# EAGLE design EMGPreamp_extRefv4 (EAGLE 6.6.0)
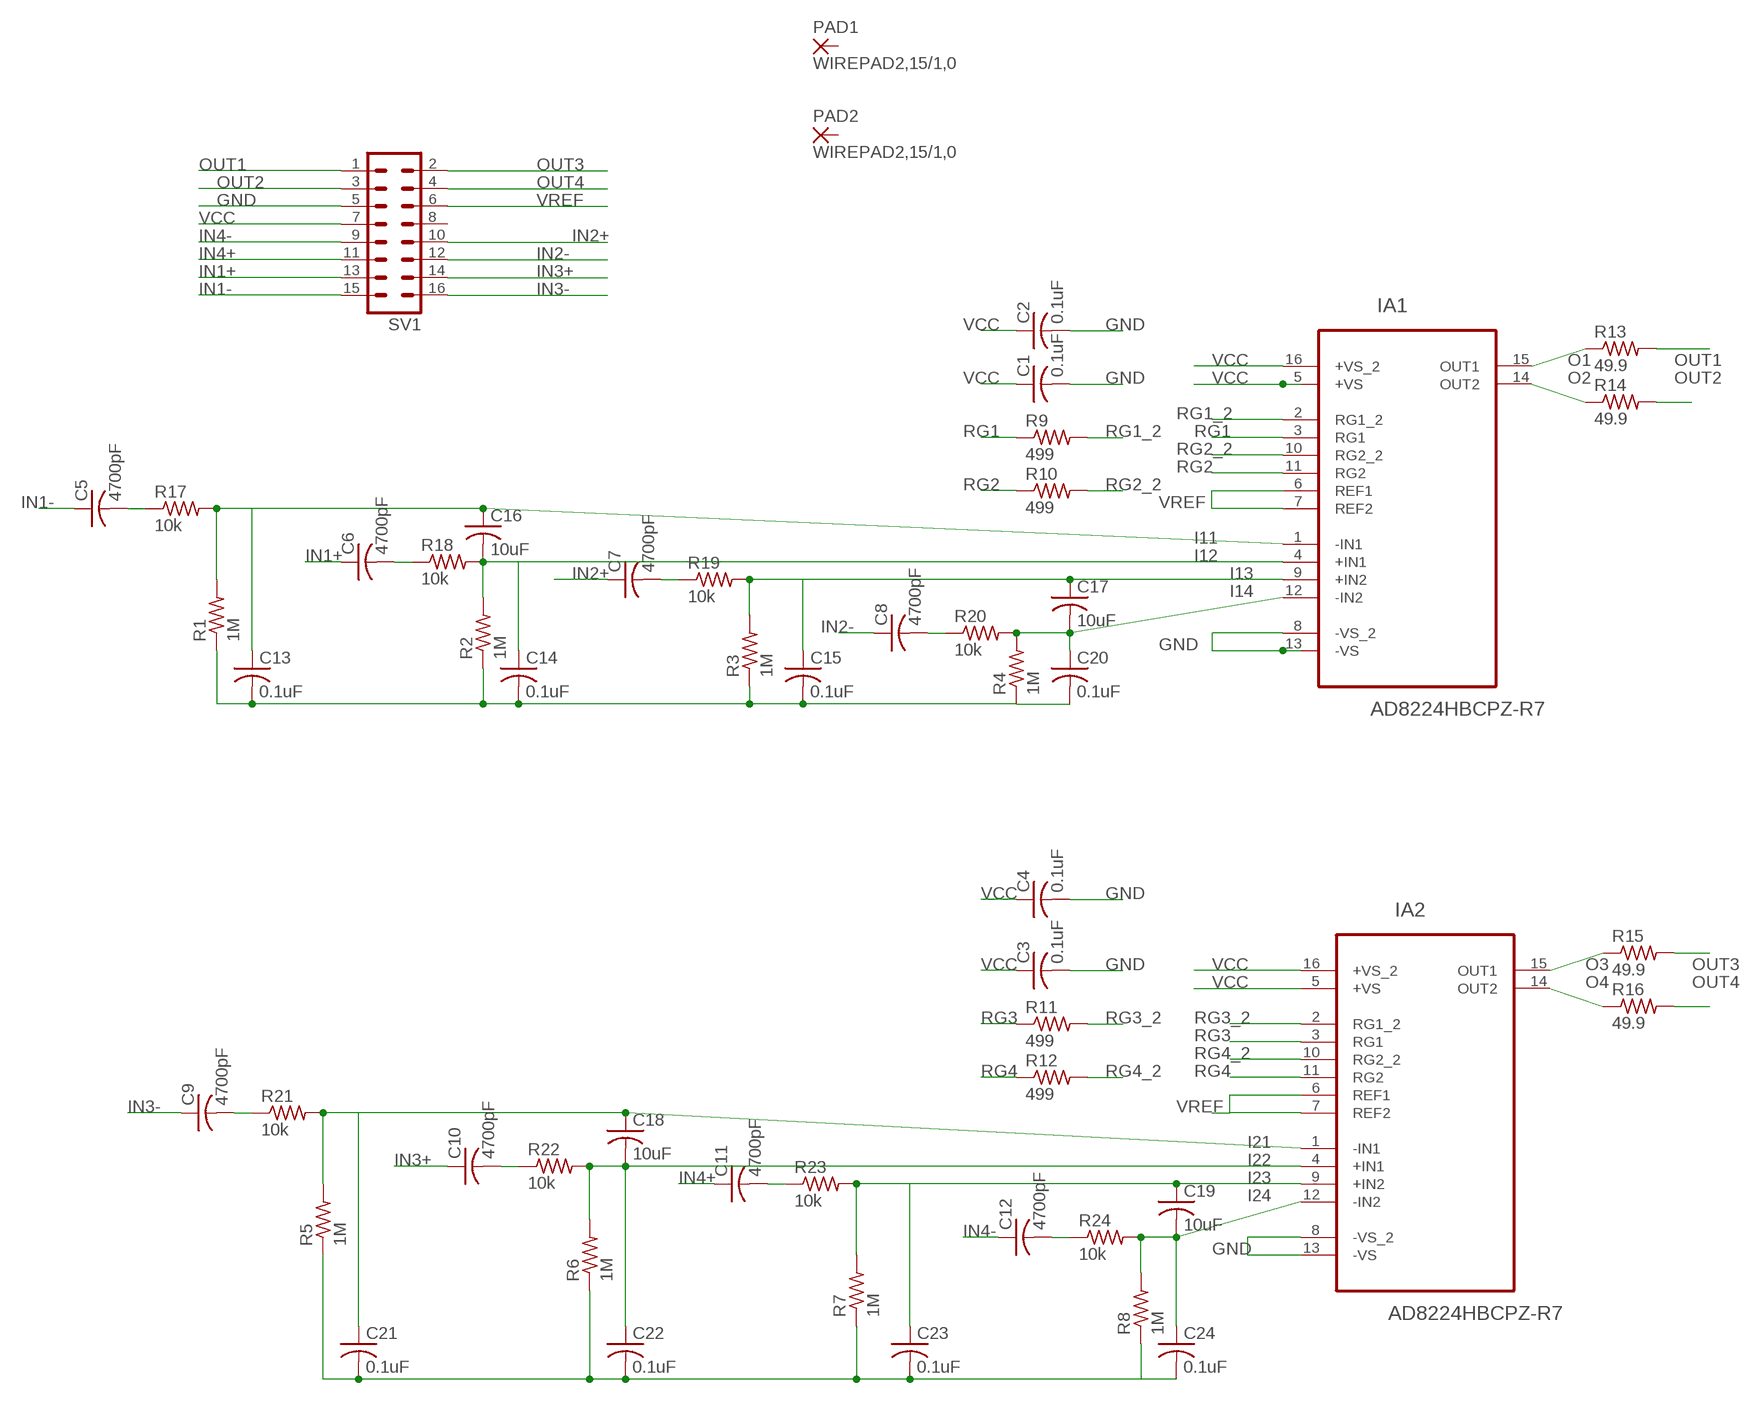
[diagram p0: schematic, sheet 1]

## Parts
C1  0.1uF  C-USC0805  [C0805]
C2  0.1uF  C-USC0805  [C0805]
C3  0.1uF  C-USC0805  [C0805]
C4  0.1uF  C-USC0805  [C0805]
C5  4700pF  C-USC0805  [C0805]
C6  4700pF  C-USC0805  [C0805]
C7  4700pF  C-USC0805  [C0805]
C8  4700pF  C-USC0805  [C0805]
C9  4700pF  C-USC0805  [C0805]
C10  4700pF  C-USC0805  [C0805]
C11  4700pF  C-USC0805  [C0805]
C12  4700pF  C-USC0805  [C0805]
C13  0.1uF  C-USC0805  [C0805]
C14  0.1uF  C-USC0805  [C0805]
C15  0.1uF  C-USC0805  [C0805]
C16  10uF  C-USC0805  [C0805]
C17  10uF  C-USC0805  [C0805]
C18  10uF  C-USC0805  [C0805]
C19  10uF  C-USC0805  [C0805]
C20  0.1uF  C-USC0805  [C0805]
C21  0.1uF  C-USC0805  [C0805]
C22  0.1uF  C-USC0805  [C0805]
C23  0.1uF  C-USC0805  [C0805]
C24  0.1uF  C-USC0805  [C0805]
IA1  AD8224HBCPZ-R7  [QFN65P400X400X100-16N]
IA2  AD8224HBCPZ-R7  [QFN65P400X400X100-16N]
PAD1  WIREPAD2,15/1,0  [2,15/1,0]
PAD2  WIREPAD2,15/1,0  [2,15/1,0]
R1  1M  R-US_R0805  [R0805]
R2  1M  R-US_R0805  [R0805]
R3  1M  R-US_R0805  [R0805]
R4  1M  R-US_R0805  [R0805]
R5  1M  R-US_R0805  [R0805]
R6  1M  R-US_R0805  [R0805]
R7  1M  R-US_R0805  [R0805]
R8  1M  R-US_R0805  [R0805]
R9  499  R-US_R0805  [R0805]
R10  499  R-US_R0805  [R0805]
R11  499  R-US_R0805  [R0805]
R12  499  R-US_R0805  [R0805]
R13  49.9  R-US_R0805  [R0805]
R14  49.9  R-US_R0805  [R0805]
R15  49.9  R-US_R0805  [R0805]
R16  49.9  R-US_R0805  [R0805]
R17  10k  R-US_R0805  [R0805]
R18  10k  R-US_R0805  [R0805]
R19  10k  R-US_R0805  [R0805]
R20  10k  R-US_R0805  [R0805]
R21  10k  R-US_R0805  [R0805]
R22  10k  R-US_R0805  [R0805]
R23  10k  R-US_R0805  [R0805]
R24  10k  R-US_R0805  [R0805]
SV1  MA08-2W  [MA08-2W]

## Nets
GND: C1.2 C2.2 C3.2 C4.2 C13.2 C14.2 C15.2 C20.2 C21.2 C22.2 C23.2 C24.2 IA1.8(-VS_2) IA1.13(-VS) IA2.8(-VS_2) IA2.13(-VS) R1.1 R2.1 R3.1 R4.1 R5.1 R6.1 R7.1 R8.1 SV1.5
I11: C13.1 C16.1 IA1.1(-IN1) R1.2 R17.2
I12: C14.1 C16.2 IA1.4(+IN1) R2.2 R18.2
I13: C15.1 C17.1 IA1.9(+IN2) R3.2 R19.2
I14: C17.2 C20.1 IA1.12(-IN2) R4.2 R20.2
I21: C18.1 C21.1 IA2.1(-IN1) R5.2 R21.2
I22: C18.2 C22.1 IA2.4(+IN1) R6.2 R22.2
I23: C19.1 C23.1 IA2.9(+IN2) R7.2 R23.2
I24: C19.2 C24.1 IA2.12(-IN2) R8.2 R24.2
IN1+: C6.1 SV1.13
IN1-: C5.1 SV1.15
IN2+: C7.1 SV1.10
IN2-: C8.1 SV1.12
IN3+: C10.1 SV1.14
IN3-: C9.1 SV1.16
IN4+: C11.1 SV1.11
IN4-: C12.1 SV1.9
N$1: C5.2 R17.1
N$2: C6.2 R18.1
N$3: C8.2 R20.1
N$4: C9.2 R21.1
N$5: C10.2 R22.1
N$6: C7.2 R19.1
N$7: C11.2 R23.1
N$8: C12.2 R24.1
O1: IA1.15(OUT1) R13.1
O2: IA1.14(OUT2) R14.1
O3: IA2.15(OUT1) R15.1
O4: IA2.14(OUT2) R16.1
OUT1: R13.2 SV1.1
OUT2: R14.2 SV1.3
OUT3: R15.2 SV1.2
OUT4: R16.2 SV1.4
RG1: IA1.3(RG1) R9.1
RG1_2: IA1.2(RG1_2) R9.2
RG2: IA1.11(RG2) R10.1
RG2_2: IA1.10(RG2_2) R10.2
RG3: IA2.3(RG1) R11.1
RG3_2: IA2.2(RG1_2) R11.2
RG4: IA2.11(RG2) R12.1
RG4_2: IA2.10(RG2_2) R12.2
VCC: C1.1 C2.1 C3.1 C4.1 IA1.5(+VS) IA1.16(+VS_2) IA2.5(+VS) IA2.16(+VS_2) SV1.7
VREF: IA1.6(REF1) IA1.7(REF2) IA2.6(REF1) IA2.7(REF2) SV1.6
Unconnected: PAD1.1(P) PAD2.1(P) SV1.8

## Library data of the parts
C1-C15 C20-C24 = rcl:C-US: CAPACITOR, American symbol
C16-C19 = resistor:C-US: CAPACITOR, American symbol
IA1 IA2 = Analog Devices_By_element14_Batch1:AD8224HBCPZ-R7: Precision, Dual-Channel, JFET Input,Rail-to-Rail Instrumentation Amplifier; MPN: AD8224HBCPZ-R7; OC_FARNELL: -; OC_NEWARK: 79R2339; PACKAGE: QFN-16; SUPPLIER: Analog Devices
PAD1 PAD2 = wirepad:WIREPAD: Wire PAD connect wire on PCB
R1-R8 R17-R24 = resistor:R-US_: RESISTOR, American symbol
R9-R16 = rcl:R-US_: RESISTOR, American symbol
SV1 = con-lstb:MA08-2W: PIN HEADER; OC_FARNELL: unknown; OC_NEWARK: unknown

## Board
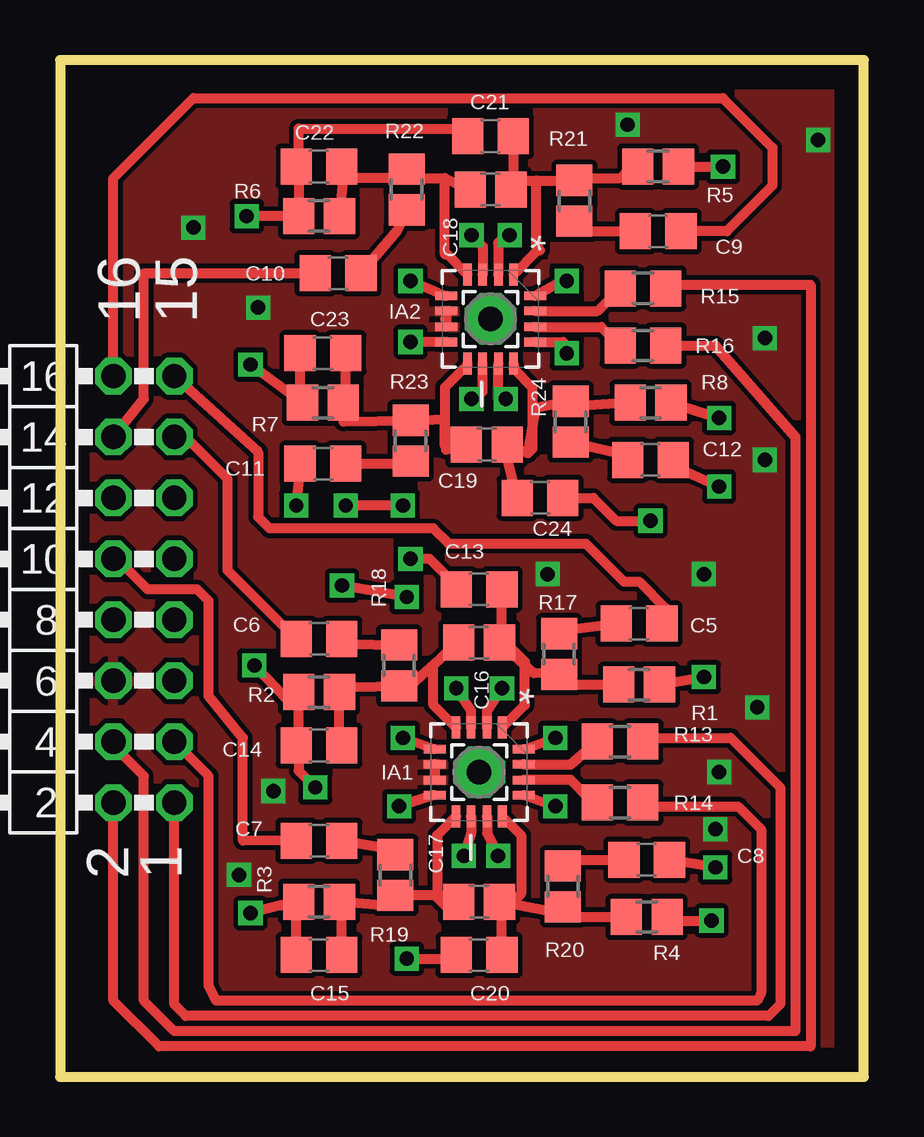
[diagram p1: board, top side]
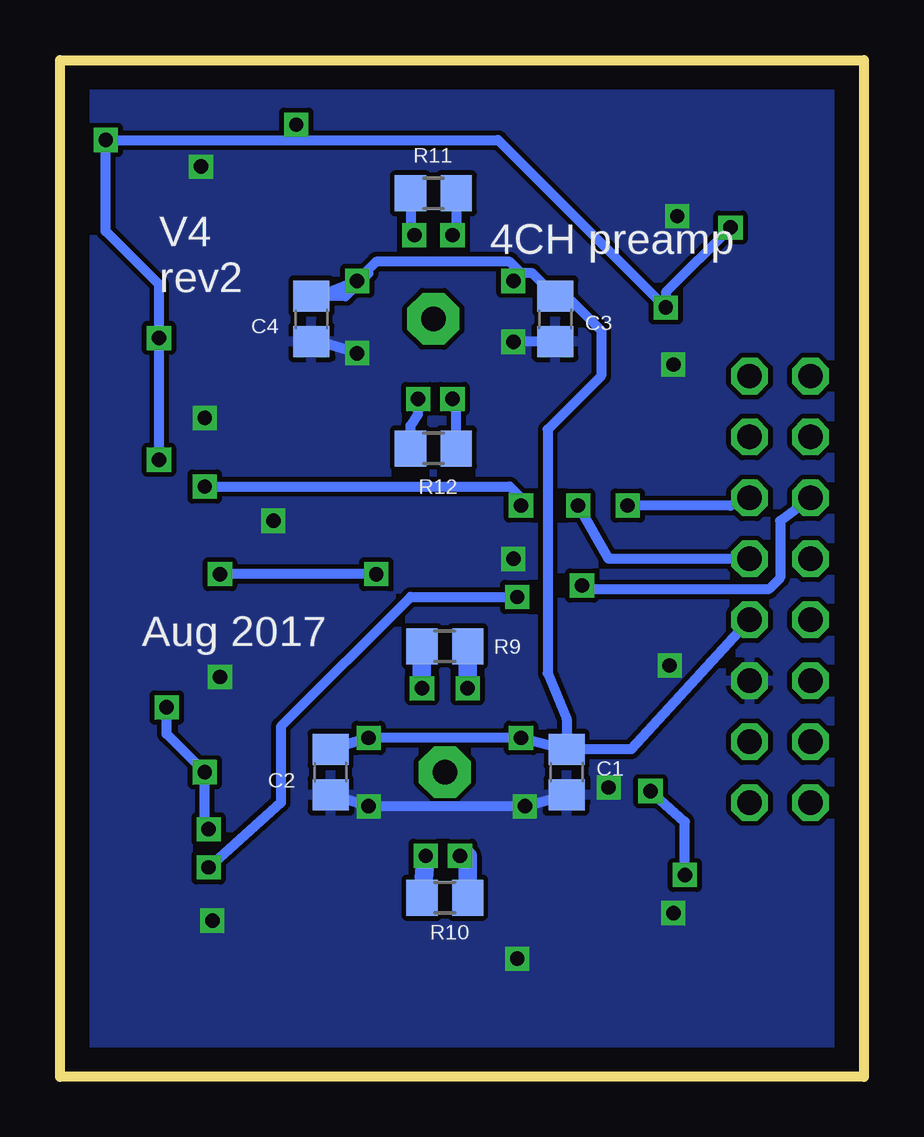
[diagram p2: board, bottom side, seen from below]

Size 33.5 x 42.39 mm. Coordinates in mm from the lower left corner, seen from the top.
Outline: 0,0 33.5,0 33.5,42.39 0,42.39 0,0
Copper layers (1*16): Top 0.035mm / dielectric 1.5mm / Bottom 0.035mm
Design rules "default *": minimum track width 10mil, minimum drill 20mil, track to track 8mil, track to pad 8mil, pad to pad 8mil, via to via 8mil, smd to smd 8mil, copper to edge 40mil, drill to drill 8mil, minimum pad ring 10mil, minimum via ring 8mil, stop-mask expansion 4mil, vias tented up to drill 0mil, thermal gap 10mil

### Footprints (pad centres in the part's own frame; a part is rotated, then mirrored left to right if it is on the bottom)
C0805 = smd 1.3 x 1.5: 1 -0.95,0; 2 0.95,0
C0805' = smd 1.3 x 1.5: 1 -0.85,0; 2 0.85,0
QFN65P400X400X100-16N = smd 0.914 x 0.356: 1 -1.854,0.965; 2 -1.854,0.33; 3 -1.854,-0.33; 4 -1.854,-0.965; 9 1.854,-0.965; 10 1.854,-0.33; 11 1.854,0.33; 12 1.854,0.965 | smd 0.356 x 0.914: 5 -0.965,-1.854; 6 -0.33,-1.854; 7 0.33,-1.854; 8 0.965,-1.854; 13 0.965,1.854; 14 0.33,1.854; 15 -0.33,1.854; 16 -0.965,1.854
2,15/1,0 = drill 1.016 pad 2.159 octagon: 1 0,0
R0805 = smd 1.3 x 1.5: 1 -0.85,0; 2 0.85,0
R0805' = smd 1.3 x 1.5: 1 -0.95,0; 2 0.95,0
MA08-2W = drill 1.016 octagon: 1 -8.89,-1.27; 2 -8.89,1.27; 3 -6.35,-1.27; 4 -6.35,1.27; 5 -3.81,-1.27; 6 -3.81,1.27; 7 -1.27,-1.27; 8 -1.27,1.27; 9 1.27,-1.27; 10 1.27,1.27; 11 3.81,-1.27; 12 3.81,1.27; 13 6.35,-1.27; 14 6.35,1.27; 15 8.89,-1.27; 16 8.89,1.27

### Placement (x,y rotation side)
C1  12.38,12.7 270 bottom
C2  22.23,12.7 270 bottom
C3  12.86,31.59 270 bottom
C4  23.02,31.59 270 bottom
C5  24.13,18.89 180 top
C6  10.79,18.26 0 top
C7  10.79,9.84 0 top
C8  24.45,9.05 180 top
C9  24.92,35.24 180 top
C10  11.59,33.5 0 top
C11  10.95,25.56 0 top
C12  24.61,25.72 180 top
C13  17.46,20.32 180 top
C14  10.79,13.81 180 top
C15  10.79,5.08 180 top
C16  10uF  [C0805']  17.46,18.1 180 top
C17  10uF  [C0805']  17.46,7.3 0 top
C18  10uF  [C0805']  17.94,36.99 180 top
C19  10uF  [C0805']  17.78,26.35 0 top
C20  17.46,5.08 180 top
C21  17.94,39.21 180 top
C22  10.79,37.94 180 top
C23  10.95,30.16 180 top
C24  20,24.13 0 top
IA1  17.46,12.7 270 top
IA2  17.94,31.59 270 top
PAD1  17.94,31.59 180 top
PAD2  17.46,12.7 180 top
R1  24.13,16.35 180 top
R2  10.79,16.03 0 top
R3  10.79,7.3 0 top
R4  24.45,6.67 180 top
R5  24.92,37.94 180 top
R6  10.79,35.88 0 top
R7  10.95,28.1 0 top
R8  24.61,28.1 180 top
R9  499  [R0805']  17.46,17.94 180 bottom
R10  499  [R0805']  17.46,7.46 0 bottom
R11  499  [R0805']  17.94,36.83 180 bottom
R12  499  [R0805']  17.94,26.19 0 bottom
R13  49.9  [R0805']  23.34,13.97 0 top
R14  49.9  [R0805']  23.34,11.43 0 top
R15  49.9  [R0805']  24.29,32.86 0 top
R16  49.9  [R0805']  24.29,30.48 0 top
R17  20.8,17.62 270 top
R18  14.13,17.14 270 top
R19  13.97,8.41 270 top
R20  20.96,7.94 270 top
R21  21.43,36.51 90 top
R22  14.45,36.99 90 top
R23  14.61,26.51 90 top
R24  21.27,27.3 90 top
SV1  3.49,20.32 90 top

### Tracks (layer width: path | path; a pad name or v marks a point on that pad's centre or on a via)
GND  (via drill 0.6)
  Top 0.406: v14.6,30.64 IA2.8 | IA2.13 20.96,30.63 v21.11,30.16 | IA1.8 15.59,11.75 v14.13,11.27 | IA1.13 19.33,11.75 v20.64,11.27 | v8.1,17.14 9.47,15.72 R2.1 9.94,13.49 | v7.94,29.69 R7.1 10,28.1 C23.2 | v7.78,35.88 R6.1 9.94,38.58 | R5.1 v27.62,37.94 | R8.1 v27.46,27.46 | R1.1 v26.83,16.67 | R4.1 25.46,6.51 v27.15,6.51 | C14.2 9.94,13.49 | C22.2 9.94,38.58 | 9.94,38.58 9.94,39.53 16.83,39.53 16.83,39.37 C21.2 | C13.2 16.51,20.48 15.4,21.59 v14.6,21.59 | C15.2 9.85,7.04 R3.1 9.21,7.14 v7.94,6.83 | v14.45,4.92 16.35,4.92 C20.2 | 9.94,13.49 9.94,12.76 v10.64,12.07 | C24.2 22.23,24.13 23.18,23.18 v24.61,23.18
  Bottom 0.406: 12.07,11.43 C1.2 v14.13,11.27 v20.64,11.27 C2.2 | C3.2 v14.6,30.64 | v21.11,30.16 22.7,30.64 C4.2
  pour Bottom: 0,42.39 33.5,42.39 33.5,0 0,0
I11
  Top 0.406: IA1.1 19.37,15.49 19.37,17.3 18.41,18.26 | 18.41,18.26 C16.1 19.74,16.83 R17.2 20.9,16.35 R1.2 | 18.41,18.26 C13.1
I12
  Top 0.406: IA1.4 15.56,15.49 15.56,17.14 16.61,18.2 C16.2 14.66,16.35 R18.2 12.22,16.25 R2.2 11.65,13.49 C14.1
I13
  Top 0.406: IA1.9 15.72,10.07 15.72,7.46 16.35,6.83 C17.1 15.87,7.56 R19.2 13.39,7.14 R3.2 11.75,7.04 C15.1
I14
  Top 0.406: IA1.12 19.21,10.07 19.21,7.62 18.41,6.83 | 18.41,6.83 C17.2 20.69,6.83 R20.2 21.37,6.67 R4.2 | C20.1 18.41,6.83
I21
  Top 0.406: R5.2 23.81,37.94 23.34,37.46 21.53,37.46 R21.2 19.84,37.36 | 19.84,37.36 19,37.36 C18.1 18.89,37.15 C21.1 | IA2.1 19.91,34.45 20,34.45 19.84,34.61 19.84,37.36
I22
  Top 0.406: 11.8,37.52 11.75,37.46 14.34,37.46 R22.2 14.66,37.46 16.03,37.46 | 11.8,37.52 R6.2 | 16.03,37.46 C18.2 | IA2.4 16.13,34.29 16.03,34.29 16.03,37.46 | C22.1 11.75,37.58 11.8,37.52
I23
  Top 0.406: 16.03,27.41 R23.2 11.8,27.3 R7.2 11.9,28.1 C23.1 | 16.03,27.41 16.08,26.14 C19.1 | IA2.9 16.97,29.67 16.03,28.73 16.03,27.41 | 16.03,26.3 16.03,27.41
I24
  Top 0.406: R8.2 21.37,27.94 R24.2 19.8,27.88 19.5,25.99 | 19.5,25.99 C19.2 18.57,26.04 C24.1 | IA2.12 18.9,29.52 19.69,28.73 19.69,26.18 19.5,25.99
IN1+
  Top 0.406: C6.1 6.98,21.11 6.98,24.92 4.92,26.99 SV1.13
IN1-
  Top 0.406: SV1.15 8.26,26.04 8.26,23.34 8.73,22.86 15.56,22.86 16.19,22.22 21.91,22.22 23.5,20.64 24.13,20.64 25.24,19.53 25.24,19.05 C5.1 25.24,18.73
IN2+
  Top 0.406: C7.1 7.62,9.84 7.62,14.13 6.19,15.88 6.19,19.84 5.72,20.32 3.65,20.32 2.38,21.59 2.22,21.11 SV1.10
IN2-  (via drill 0.6)
  Top 0.406: v27.3,8.73 C8.1 | v14.45,20 v11.75,20.48
  Bottom 0.406: SV1.12 3.49,23.18 3.49,20.8 3.97,20.32 11.27,20.32 v11.75,20.48 | v27.3,8.73 24.29,11.43 24.29,14.61 18.89,20 v14.45,20
IN3+
  Top 0.406: SV1.14 3.49,28.26 3.49,33.5 C10.1
IN3-
  Top 0.406: SV1.16 2.22,37.46 5.56,40.8 27.62,40.8 29.69,38.73 29.69,37.15 27.78,35.24 C9.1
IN4+  (via drill 0.6)
  Top 0.406: v9.84,23.81 10,25.24 C11.1
  Bottom 0.406: SV1.11 5.56,23.81 v9.84,23.81
IN4-  (via drill 0.6)
  Top 0.406: C12.1 25.72,25.4 v27.46,24.61 | v14.29,23.81 v11.91,23.81
  Bottom 0.406: SV1.9 10.64,21.59 v11.91,23.81 | v27.46,24.61 14.76,24.61 14.13,23.97 v14.29,23.81
N$1
  Top 0.406: R17.1 20.74,18.57 C5.2
N$2
  Top 0.406: C6.2 12.01,18.04 R18.1
N$3
  Top 0.406: R20.1 21.22,9.05 C8.2
N$4
  Top 0.406: R21.1 21.85,35.24 C9.2
N$5
  Top 0.406: R22.1 14.03,35.24 C10.2
N$6
  Top 0.406: R19.1 13.55,9.53 C7.2
N$7
  Top 0.406: C11.2 14.18,25.56 R23.1
N$8
  Top 0.406: R24.1 23.55,25.93 C12.2
N$9
  pour Bottom: 0,42.39 33.5,42.39 33.5,0 0,0
O1
  Top 0.406: IA1.15 19.33,13.02 21.28,13.02 R13.1
O2
  Top 0.406: R14.1 22.08,11.57 21.27,12.38 19.33,12.38 IA1.14
O3
  Top 0.406: IA2.15 22.4,31.92 R15.1
O4
  Top 0.406: IA2.14 22.56,31.26 R16.1
OUT1
  Top 0.406: R13.2 24.44,14.13 27.94,14.13 30,12.07 30,3.02 29.53,2.54 5.24,2.54 4.76,3.02 SV1.1
OUT2
  Top 0.406: R14.2 24.44,11.27 28.26,11.27 29.21,10.32 29.21,3.49 29.05,3.17 6.51,3.17 6.19,3.81 6.19,12.54 SV1.3
OUT3
  Top 0.406: R15.2 25.4,33.02 31.27,33.02 31.27,1.27 4.13,1.27 2.22,3.17 SV1.2
OUT4
  Top 0.406: R16.2 27.3,30.48 30.64,26.67 30.64,1.91 4.76,1.91 3.49,3.17 3.49,12.54 2.22,13.81 SV1.4
RG1  (via drill 0.6)
  Top 0.406: IA1.3 17.13,15.25 v16.51,16.19
  Bottom 0.406: 16.51,17.78 R9.1
  Bottom 0.762: v16.51,16.19 16.51,17.78
RG1_2  (via drill 0.6)
  Top 0.406: IA1.2 17.79,15.25 v18.41,16.19
  Bottom 0.406: 18.41,17.78 R9.2
  Bottom 0.762: v18.41,16.19 18.41,17.78
RG2  (via drill 0.6)
  Top 0.406: IA1.11 17.79,10.15 v18.26,9.21
  Bottom 0.406: 18.41,7.3 R10.1
  Bottom 0.762: v18.26,9.21 18.41,7.3
RG2_2  (via drill 0.6)
  Top 0.406: IA1.10 17.13,10.15 v16.83,9.21
  Bottom 0.406: v16.83,9.21 16.51,9.21 | 16.51,7.3 R10.2
  Bottom 0.762: 16.51,9.21 16.51,7.3
RG3  (via drill 0.6)
  Top 0.406: v17.14,35.08 17.62,34.61 IA2.3
  Bottom 0.406: R11.1 16.99,35.24 v17.14,35.08
RG3_2  (via drill 0.6)
  Top 0.406: v18.73,35.08 18.57,35.08 18.26,34.77 18.26,33.46 IA2.2
  Bottom 0.406: R11.2 18.89,35.24 v18.73,35.08
RG4  (via drill 0.6)
  Top 0.406: v18.57,28.26 18.27,28.24 IA2.11
  Bottom 0.406: R12.1 18.89,27.15 18.57,27.62 v18.57,28.26
RG4_2  (via drill 0.6)
  Top 0.406: v17.14,28.26 17.14,28.1 17.61,28.56 IA2.10
  Bottom 0.406: R12.2 16.99,27.78 v17.14,28.26
VCC  (via drill 0.6)
  Top 0.406: v14.6,33.18 16.08,32.54 IA2.5 | IA2.16 20.96,33.19 v21.11,33.18 | IA1.5 15.59,13.65 v14.29,14.13 | IA1.16 19.33,13.65 v20.64,14.13
  Bottom 0.406: v14.6,33.18 14.6,33.49 14.45,33.49 14.29,33.5 | C1.1 v14.29,14.13 v20.64,14.13 C2.1 | 14.29,33.5 13.81,33.5 C3.1 12.38,32.54 10.95,31.11 10.95,29.21 13.18,26.99 13.18,16.83 12.38,14.92 C1.1 | 20.64,33.5 21.59,32.54 C4.1 22.7,32.54 v21.11,33.18 20.32,33.97 14.76,33.97 14.29,33.5 | SV1.7 9.69,13.65 C1.1
VREF  (via drill 0.6)
  Top 0.406: IA1.6 IA1.7 15.54,12.37 | IA2.6 IA2.7 | 16.07,31.91 IA2.6 | IA2.6 16.08,31.64 16.03,31.59
  Bottom 0.406: v27.3,10.32 27.46,10.48 v27.46,12.7 29.05,14.29 v29.05,15.4 | v7.46,8.41 7.46,10.64 v8.89,11.91 | v29.37,25.72 v29.37,30.8 29.37,33.02 31.59,35.24 v31.59,39.05 23.65,39.05 | 23.65,39.05 15.24,39.05 v8.26,32.07 8.26,32.7 v5.56,35.4 | v23.65,39.69 23.65,39.05 | v20.32,20.95 v26.83,20.95
  pour Top: 0,42.39 33.5,42.23 33.5,-0.16 0,0

### Text on the board
tNames: 16 | 15 | 2 | 1
bNames: 4CH preamp | V4 / rev2 | Aug 2017